# EAGLE design Talko_1_2 (EAGLE 7.5.0)
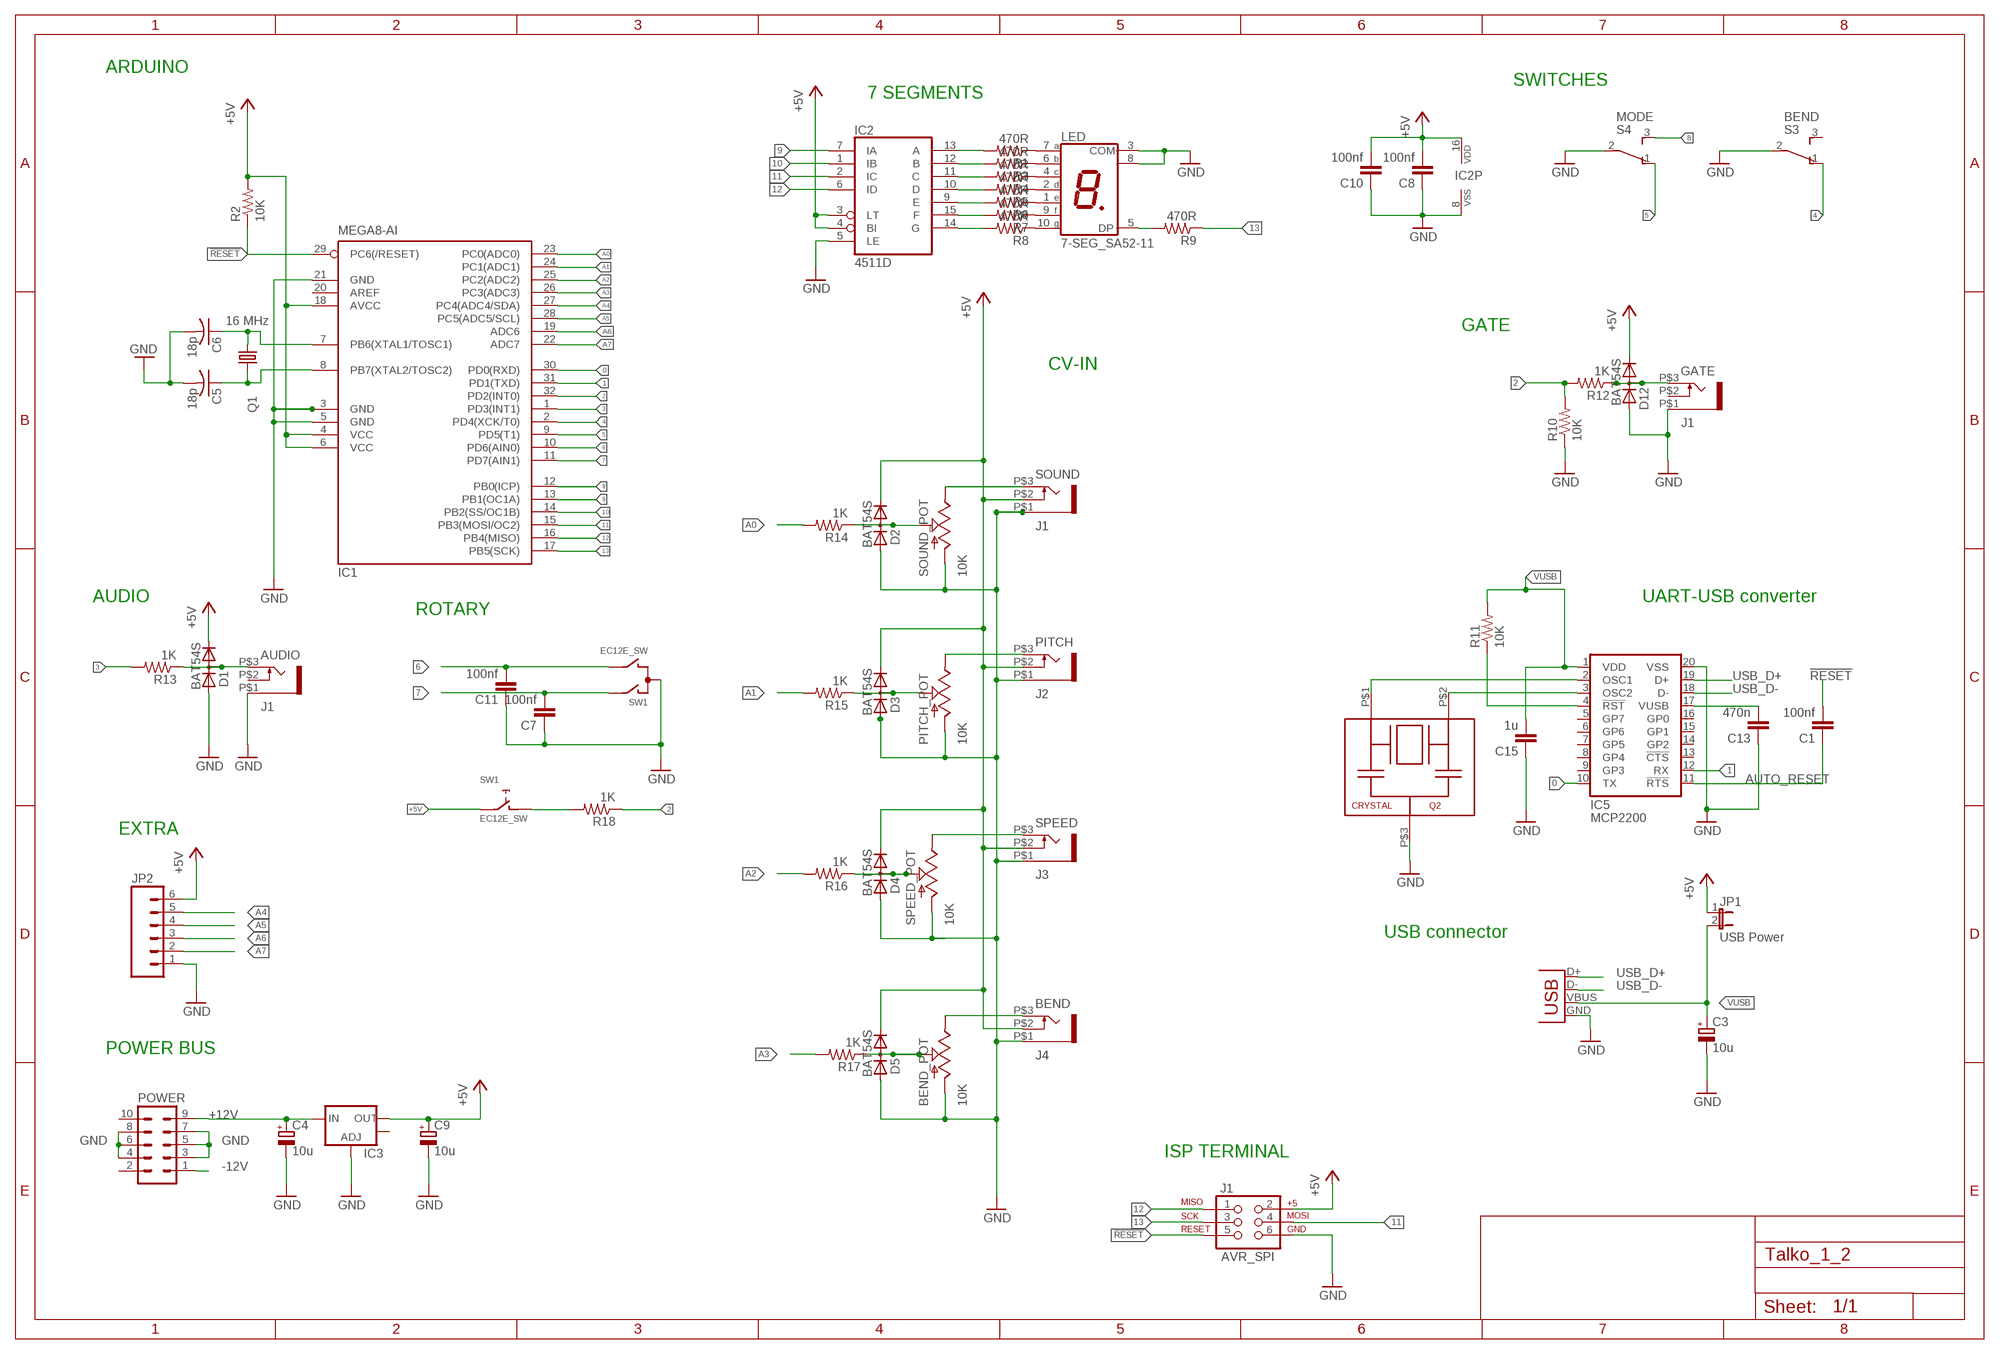
[diagram p0: schematic, sheet 1]

## Parts
AUDIO  J1  THONKICONN  [THONKICONN]
BEND  J4  THONKICONN  [THONKICONN]
BEND_POT  10K  POT  [ALPS_POT]
C1  100nf  C-EUC0805  [C0805]
C3  10u  CPOL-EUR/2012-12R  [R/2012-12R]
C4  10u  CPOL-EUR/2012-12R  [R/2012-12R]
C5  18p  C-USC0805K  [C0805K]
C6  18p  C-USC0805K  [C0805K]
C7  100nf  C-EUC0805  [C0805]
C8  100nf  C-EUC0805  [C0805]
C9  10u  CPOL-EUR/2012-12R  [R/2012-12R]
C10  100nf  C-EUC0805  [C0805]
C11  100nf  C-EUC0805  [C0805]
C13  470n  CAP0805  [0805]
C15  1u  CAP0805  [0805]
D1  BAT54S  DIODE_2CACA-SOT23  [SOT23]
D2  BAT54S  DIODE_2CACA-SOT23  [SOT23]
D3  BAT54S  DIODE_2CACA-SOT23  [SOT23]
D4  BAT54S  DIODE_2CACA-SOT23  [SOT23]
D5  BAT54S  DIODE_2CACA-SOT23  [SOT23]
D12  BAT54S  DIODE_2CACA-SOT23  [SOT23]
GATE  J1  THONKICONN  [THONKICONN]
IC1  MEGA8-AI  [TQFP32-08]
IC2  4511D  [SO16]
IC3  V_REG_LM1117SOT223  [SOT223]
IC5  MCP2200  [SO20]
J1  AVR_SPI  AVR_SPI_PRG_62X3_LOCK  [2X3_LOCK]
JP1  USB Power  JP1E  [JP1]
JP2  M06SIP  [1X06]
LED  7-SEG_SA52-11  [SA52-11]
PITCH  J2  THONKICONN  [THONKICONN]
PITCH_POT  10K  POT  [ALPS_POT]
POWER  10_PIN_HEADER  [MA05-2]
Q1  16 MHz  CRYSTALCTS406  [CTS406]
Q2  CRYSTAL  [CRYSTAL]
R1  470R  R-US_M0805  [M0805]
R2  10K  R-US_M0805  [M0805]
R3  470R  R-US_M0805  [M0805]
R4  470R  R-US_M0805  [M0805]
R5  470R  R-US_M0805  [M0805]
R6  470R  R-US_M0805  [M0805]
R7  470R  R-US_M0805  [M0805]
R8  470R  R-US_M0805  [M0805]
R9  470R  R-US_M0805  [M0805]
R10  10K  R-US_M0805  [M0805]
R11  10K  R-US_M0805  [M0805]
R12  1K  R-US_M0805  [M0805]
R13  1K  R-US_M0805  [M0805]
R14  1K  R-US_M0805  [M0805]
R15  1K  R-US_M0805  [M0805]
R16  1K  R-US_M0805  [M0805]
R17  1K  R-US_M0805  [M0805]
R18  1K  R-US_M0805  [M0805]
S3  BEND  TL36PO  [TL3XPO]
S4  MODE  TL36PO  [TL3XPO]
SOUND  J1  THONKICONN  [THONKICONN]
SOUND_POT  10K  POT  [ALPS_POT]
SPEED  J3  THONKICONN  [THONKICONN]
SPEED_POT  10K  POT  [ALPS_POT]
SW1  EC12E_SW  [ALPS_EC12E_SW]
X3  USB  USBPTH-VERTICAL  [USB-B-PTH-VERTICAL]

## Nets
0: IC1.30(PD0(RXD)) IC5.10(TX)
1: IC1.31(PD1(TXD)) IC5.12(RX)
2: IC1.32(PD2(INT0)) R10.2 R12.2 R18.1
3: IC1.1(PD3(INT1)) R13.2
4: IC1.2(PD4(XCK/T0)) S3.1(O)
5: IC1.9(PD5(T1)) S4.1(O)
6: C11.2 IC1.10(PD6(AIN0)) SW1.B
7: C7.2 IC1.11(PD7(AIN1)) SW1.A
8: IC1.12(PB0(ICP)) S4.3(S)
9: IC1.13(PB1(OC1A)) IC2.7(IA)
10: IC1.14(PB2(SS/OC1B)) IC2.1(IB)
11: IC1.15(PB3(MOSI/OC2)) IC2.2(IC) J1.4
12: IC1.16(PB4(MISO)) IC2.6(ID) J1.1
13: IC1.17(PB5(SCK)) J1.3 R9.1
!RESET: C1.2 IC1.29(PC6(/RESET)) J1.5 R2.1
+5V: BEND.P$2 C8.2 C9.+ C10.2 D1.2(C) D2.2(C) D3.2(C) D4.2(C) D5.2(C) D12.2(C) IC1.4(VCC) IC1.6(VCC) IC1.18(AVCC) IC2.3(LT) IC2.4(BI) IC2.16(VDD) IC3.2(OUT) J1.2 JP1.1 JP2.6 PITCH.P$2 R2.2 SOUND.P$2 SPEED.P$2 SW1.E
+12V: C4.+ IC3.3(IN) POWER.9
-12V [power]: POWER.1
A0: IC1.23(PC0(ADC0)) R14.2
A1: IC1.24(PC1(ADC1)) R15.2
A2: IC1.25(PC2(ADC2)) R16.2
A3: IC1.26(PC3(ADC3)) R17.2
A4: IC1.27(PC4(ADC4/SDA)) JP2.5
A5: IC1.28(PC5(ADC5/SCL)) JP2.4
A6: IC1.19(ADC6) JP2.3
A7: IC1.22(ADC7) JP2.2
AUTO_RESET: C1.1 IC5.11(!RTS)
GND: AUDIO.P$1 BEND.P$1 BEND_POT.P$3(A) C3.- C4.- C5.2 C6.2 C7.1 C8.1 C9.- C10.1 C11.1 C13.1 C15.1 D1.1(A) D2.1(A) D3.1(A) D4.1(A) D5.1(A) D12.1(A) GATE.P$1 IC1.3(GND) IC1.5(GND) IC1.21(GND) IC2.5(LE) IC2.8(VSS) IC3.1(ADJ) IC5.20(VSS) J1.6 JP2.1 LED.3(COM) LED.8(COM) PITCH.P$1 PITCH_POT.P$3(A) POWER.3 POWER.4 POWER.5 POWER.6 POWER.7 POWER.8 Q2.P$3 R10.1 S3.2(P) S4.2(P) SOUND.P$1 SOUND_POT.P$3(A) SPEED.P$1 SPEED_POT.P$3(A) SW1.C X3.GND
N$1: D12.3(AC) GATE.P$3 R12.1
N$2: SOUND.P$3 SOUND_POT.P$1(E)
N$3: C5.1 IC1.8(PB7(XTAL2/TOSC2)) Q1.1
N$4: LED.5(DP) R9.2
N$5: PITCH.P$3 PITCH_POT.P$1(E)
N$6: AUDIO.P$3 D1.3(AC) R13.1
N$7: SPEED.P$3 SPEED_POT.P$1(E)
N$8: IC2.13(A) R1.2
N$9: D2.3(AC) R14.1 SOUND_POT.P$2(S)
N$10: LED.7(A) R1.1
N$11: IC5.3(OSC2) Q2.P$2
N$12: C6.1 IC1.7(PB6(XTAL1/TOSC1)) Q1.3
N$13: R18.2 SW1.D
N$15: IC2.12(B) R3.2
N$16: LED.6(B) R3.1
N$17: IC2.11(C) R4.2
N$18: LED.4(C) R4.1
N$19: IC2.10(D) R5.2
N$20: LED.2(D) R5.1
N$21: IC2.9(E) R6.2
N$22: LED.1(E) R6.1
N$23: IC2.15(F) R7.2
N$24: LED.9(F) R7.1
N$25: IC2.14(G) R8.2
N$26: LED.10(G) R8.1
N$27: IC5.2(OSC1) Q2.P$1
N$28: IC5.4(!RST) R11.1
N$29: C13.2 IC5.17(VUSB)
N$30: D4.3(AC) R16.1 SPEED_POT.P$2(S)
N$31: D3.3(AC) PITCH_POT.P$2(S) R15.1
N$33: BEND_POT.P$2(S) D5.3(AC) R17.1
N$36: BEND.P$3 BEND_POT.P$1(E)
USB_D+: IC5.19(D+) X3.D+
USB_D-: IC5.18(D-) X3.D-
VUSB: C3.+ C15.2 IC5.1(VDD) JP1.2 R11.2 X3.VBUS
Unconnected: AUDIO.P$2 GATE.P$2 IC1.20(AREF) IC3.4(OUT) IC5.5(GP7) IC5.6(GP6) IC5.7(GP5) IC5.8(GP4) IC5.9(GP3) IC5.13(!CTS) IC5.14(GP2) IC5.15(GP1) IC5.16(GP0) POWER.2 POWER.10 S3.3(S) SW1.GND1(G) SW1.GND2(G)

## Notes on the sheet
- ARDUINO
- SWITCHES
- 7 SEGMENTS
- GATE
- CV-IN
- AUDIO | UART-USB converter
- ROTARY
- EXTRA
- USB connector
- POWER BUS
- ISP TERMINAL

## Library data of the parts
AUDIO BEND GATE PITCH SOUND SPEED = thonkiconn:THONKICONN
BEND_POT PITCH_POT SOUND_POT SPEED_POT = SparkFun-Electromechanical:POT; OC_FARNELL: 1769829; OC_MOUSER: 688-RK09L1140A2U
C1 C7 C8 C10 C11 = resistor:C-EU: CAPACITOR, European symbol; OC_MOUSER: 77-VJ0805V104MXBPBC
C3 C4 C9 = rcl:CPOL-EU: POLARIZED CAPACITOR, European symbol; OC_FARNELL: 1236657; OC_MOUSER: 581-F981C106MSAAS1
C5 C6 = rcl:C-US: CAPACITOR, American symbol; OC_MOUSER: 77-VJ0805A180GXQCBC
C13 = SparkFun:CAP: Capacitor Standard 0603 ceramic capacitor, and 0.1" leaded capacitor.; OC_FARNELL: 1457660; OC_MOUSER: 77-VJ0805Y474KXQTBC
C15 = SparkFun:CAP: Capacitor Standard 0603 ceramic capacitor, and 0.1" leaded capacitor.; OC_FARNELL: 2112910; OC_MOUSER: 77-VJ0805Y105KXQTBC
D1-D5 D12 = diode:DIODE_2CACA-: 2 Diodes - Cathode-Anode|Cathode-Anode; OC_MOUSER: 78-BAT54S-E3-08
IC1 = atmel:MEGA8: MICROCONTROLLER 8 Kbytes FLASH, 1 kbytes SRAM, 512 bytes EEPROM, USART, 6-channel 10 bit ADC, 2-channel 8 bit ADC Pin compatible with Atmega48, ATMega88, ATMega168 Source: avr.lbr; MPN: ATMEGA8-16AU; OC_FARNELL: 9171371; OC_MOUSER: 556-ATMEGA328P-AU; OC_NEWARK: 73M8863
IC2 = 45xx:4511: BCD to 7-segment LATCH/DECODER/DRIVER; OC_MOUSER: 863-MC14511BDG
IC3 = SparkFun-PowerIC:V_REG_LM1117: Voltage Regulator LM1117 Standard adjustable voltage regulator but in SMD form. Spark Fun Electronics SKU : COM-00595; OC_MOUSER: 621-AZ1117H-5.0TRE
IC5 = SteveMarple:MCP2200: MCP2200 Microchip USB-UART interface.; OC_FARNELL: 1781148; OC_MOUSER: 579-MCP2200-I/SO
J1 = SparkFun-Connectors:AVR_SPI_PRG_6: AVR ISP 6 Pin This is the reduced ISP connector for AVR programming. Common on Arduino. This footprint will take up less PCB space and can be used with a 10-pin to 6-pin adapter such as SKU: BOB-08508; OC_MOUSER: 571-826925-3
JP1 = jumper:JP1E: JUMPER; OC_MOUSER: 571-826646-2
JP2 = DECADE-libraries:M06: Header 6 Standard 6-pin 0.1" header. Use with straight break away headers (SKU : PRT-00116), right angle break away headers (PRT-00553), swiss pins (PRT-00743), machine pins (PRT-00117), and female headers (PRT-00115). Molex polarized connector foot print use with SKU : PRT-08094 with associated crimp pins and housings. NOTES ON THE VARIANTS LOCK and LOCK_LONGPADS... This footprint was designed to help hold the alignment of a through-hole component (i.e. 6-pin header) while soldering it into place. You may notice that each hole has been shifted either up or down by 0.005 of an inch from it's more standard position (which is a perfectly straight line). This slight alteration caused the pins (the squares in the middle) to touch the edges of the holes. Because they are alternating, it causes a "brace" to hold the component in place. 0.005 has proven to be the perfect amount of "off-center" position when using our standard breakaway headers. Although looks a little odd when you look at the bare footprint, once you have a header in there, the alteration is very hard to notice. Also, if you push a header all the way into place, it is covered up entirely on the bottom side. This idea of altering the position of holes to aid alignment will be further integrated into the Sparkfun Library for other footprints. It can help hold any component with 3 or more connection pins.
LED = display-kingbright:7-SEG_: Kingbright 14.2mm (0.56 INCH) SINGLE DIGIT NUMERIC DUISPLAY Source: SA56-11EWA(Ver1189471036.pdf; OC_FARNELL: 1168602; OC_MOUSER: 604-SC52-11SRWA; OC_NEWARK: unknown
POWER = TomW:10_PIN_HEADER: PIN HEADER; OC_FARNELL: unknown; OC_MOUSER: 571-5-146258-5; OC_NEWARK: unknown
Q1 = crystal:CRYSTAL: CRYSTAL; OC_FARNELL: unknown; OC_MOUSER: 774-406C35S16M00000; OC_NEWARK: unknown
Q2 = 57466:CRYSTAL; OC_FARNELL: 1218535; OC_MOUSER: 581-PBRC12.00HR50X
R1 R3-R9 = resistor:R-US_: RESISTOR, American symbol; OC_MOUSER: 754-RR1220P-471D
R2 R10 R11 = resistor:R-US_: RESISTOR, American symbol; OC_MOUSER: 754-RR1220P-103D
R12-R18 = resistor:R-US_: RESISTOR, American symbol; OC_MOUSER: 71-TNPW08051K00BEEA
S3 S4 = switch:TL36PO: TINY SWITCH ON - ON Source: http://www2.produktinfo.conrad.com/datenblaetter/700000-724999/705152-da-01-de-Subminiaturschalter_TL_36YO.pdf; OC_FARNELL: 9472967; OC_MOUSER: 612-200ASP1T1A1M2R
SW1 = switch-alps:EC12E_SW: ALPS rotary Encoder EC12E series with switch; MPN: EC12E2424407; OC_FARNELL: 1520813; OC_MOUSER: PEC11R-4215K-S0024; OC_NEWARK: 74M1068
X3 = SteveMarple:USB: USB Connectors USB-B-PTH is fully proven SKU : PRT-00139 USB-miniB is fully proven SKU : PRT-00587 USB-A-PCB is untested. USB-A-H is throughly reviewed, but untested. Spark Fun Electronics SKU : PRT-00437 USB-B-SMT is throughly reviewed, but untested. Needs silkscreen touching up. USB-A-S has not been used/tested USB-MB-H has not been used/tested; OC_MOUSER: 855-M701-330442

## Net classes
1 power: width 0.61 mm
2 ground: width 0.61 mm

## Board
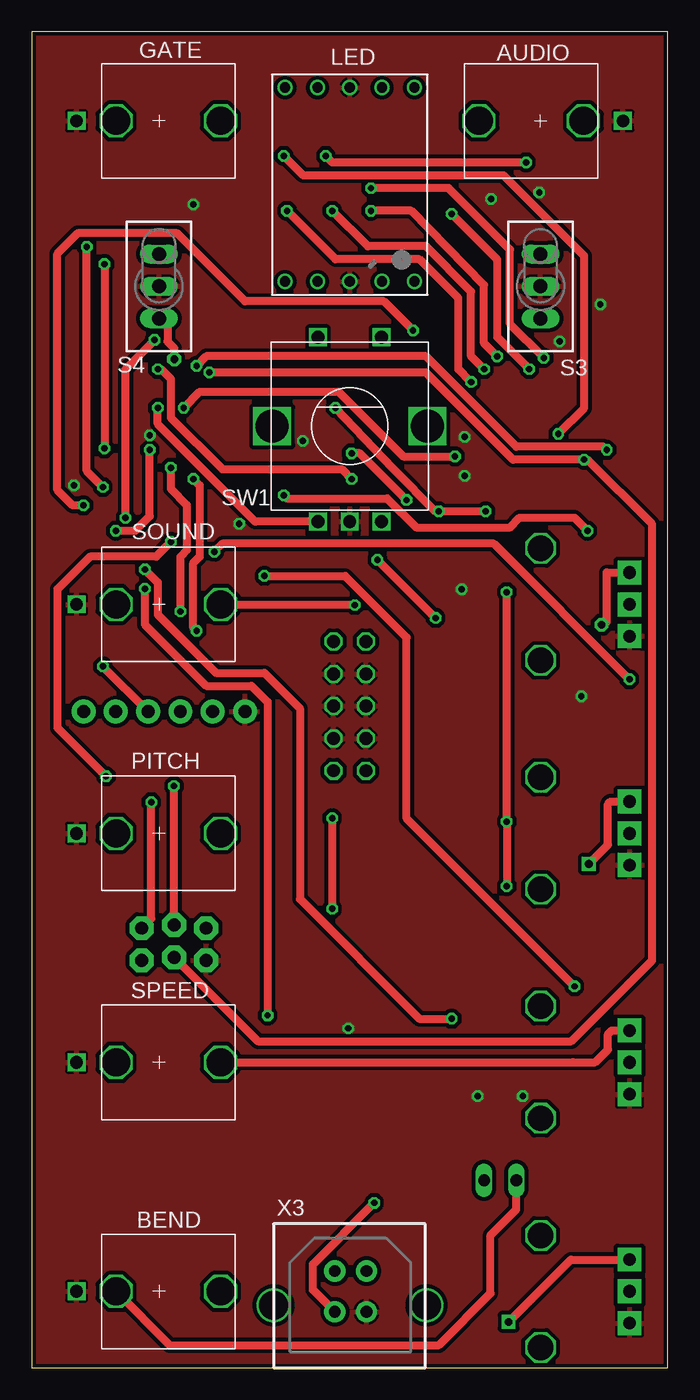
[diagram p1: board, top side]
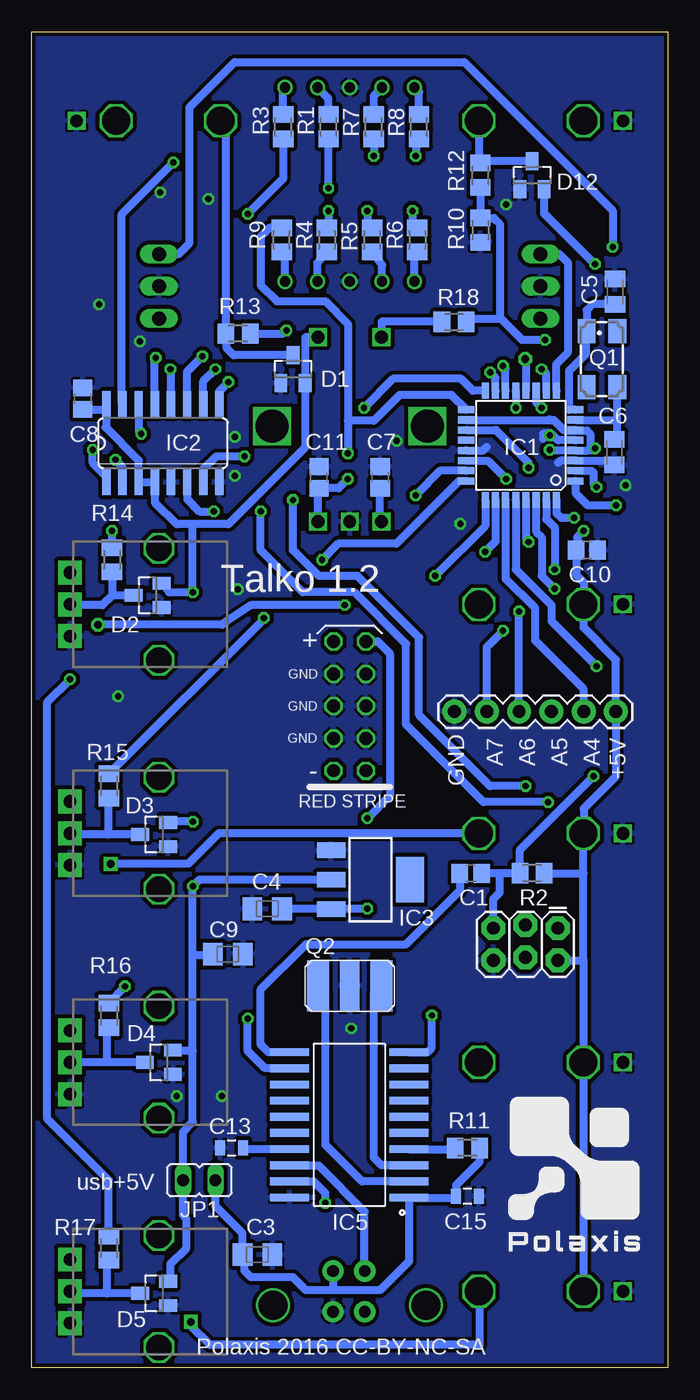
[diagram p2: board, bottom side, seen from below]

Size 50 x 105 mm. Coordinates in mm from the lower left corner, seen from the top.
Outline: 0,0 50,0 50,105 0,105 0,0
Copper layers (1*16): Top 0.035mm / dielectric 1.5mm / Bottom 0.035mm
Design rules "PCB-POOL Standard": minimum track width 0.15mm, minimum drill 0.3mm, track to track 0.15mm, track to pad 0.15mm, pad to pad 0.15mm, via to via 0.15mm, smd to smd 0.15mm, copper to edge 0.3mm, drill to drill 0.2mm, minimum pad ring 0.2mm, minimum via ring 0.15mm, stop-mask expansion 0.075mm, vias tented up to drill 0mil, thermal gap 0.2mm

### Footprints (pad centres in the part's own frame; a part is rotated, then mirrored left to right if it is on the bottom)
THONKICONN = drill 1 square: P$1 0,-6.48 | drill 2.2 octagon: P$2 0,-3.38; P$3 0,4.84
ALPS_POT = drill 1 pad 1.88 square: P$1 7,-2.5; P$2 7,0; P$3 7,2.5 | drill 2 octagon: P$4 0,-4.4; P$5 0,4.4
C0805 = smd 1.3 x 1.5: 1 -0.85,0; 2 0.85,0
R/2012-12R = smd 1.55 x 1.8: + 1.175,0; - -1.175,0
C0805K = smd 1.3 x 1.6: 1 -1,0; 2 1,0
0805 = smd 0.8 x 1.2: 1 -0.9,0; 2 0.9,0
SOT23 = smd 1 x 1.4: 1 -0.95,-1.1; 2 0.95,-1.1; 3 0,1.1
TQFP32-08 = smd 1.27 x 0.559: 1 -4.293,2.8; 2 -4.293,2; 3 -4.293,1.2; 4 -4.293,0.4; 5 -4.293,-0.4; 6 -4.293,-1.2; 7 -4.293,-2; 8 -4.293,-2.8; 17 4.293,-2.8; 18 4.293,-2; 19 4.293,-1.2; 20 4.293,-0.4; 21 4.293,0.4; 22 4.293,1.2; 23 4.293,2; 24 4.293,2.8 | smd 0.559 x 1.27: 9 -2.8,-4.293; 10 -2,-4.293; 11 -1.2,-4.293; 12 -0.4,-4.293; 13 0.4,-4.293; 14 1.2,-4.293; 15 2,-4.293; 16 2.8,-4.293; 25 2.8,4.293; 26 2,4.293; 27 1.2,4.293; 28 0.4,4.293; 29 -0.4,4.293; 30 -1.2,4.293; 31 -2,4.293; 32 -2.8,4.293
SO16 = smd 0.66 x 2.032: 1 -4.445,-3.073; 2 -3.175,-3.073; 3 -1.905,-3.073; 4 -0.635,-3.073; 5 0.635,-3.073; 6 1.905,-3.073; 7 3.175,-3.073; 8 4.445,-3.073; 9 4.445,3.073; 10 3.175,3.073; 11 1.905,3.073; 12 0.635,3.073; 13 -0.635,3.073; 14 -1.905,3.073; 15 -3.175,3.073; 16 -4.445,3.073
SOT223 = smd 1.219 x 2.235: 1 -2.311,-3.099; 2 0,-3.099; 3 2.311,-3.099 | smd 3.6 x 2.2: 4 0,3.099
SO20 = smd 0.61 x 3.048: 1 -5.715,-4.699; 2 -4.445,-4.699; 3 -3.175,-4.699; 4 -1.905,-4.699; 5 -0.635,-4.699; 6 0.635,-4.699; 7 1.905,-4.699; 8 3.175,-4.699; 9 4.445,-4.699; 10 5.715,-4.699; 11 5.715,4.699; 12 4.445,4.699; 13 3.175,4.699; 14 1.905,4.699; 15 0.635,4.699; 16 -0.635,4.699; 17 -1.905,4.699; 18 -3.175,4.699; 19 -4.445,4.699; 20 -5.715,4.699
2X3_LOCK = drill 1.016 pad 1.88 octagon: 1 0,0; 2 0,2.54; 3 2.54,-0.254; 4 2.54,2.286; 5 5.08,0; 6 5.08,2.54
JP1 = drill 0.914 long: 1 0,-1.27; 2 0,1.27
1X06 = drill 1.016 pad 1.88: 1 0,0; 2 2.54,0; 3 5.08,0; 4 7.62,0; 5 10.16,0; 6 12.7,0
SA52-11 = drill 0.8: 1 -5.08,-7.62; 2 -2.54,-7.62; 3 0,-7.62; 4 2.54,-7.62; 5 5.08,-7.62; 6 5.08,7.62; 7 2.54,7.62; 8 0,7.62; 9 -2.54,7.62; 10 -5.08,7.62
MA05-2 = drill 1.016 octagon: 1 -5.08,-1.27; 2 -5.08,1.27; 3 -2.54,-1.27; 4 -2.54,1.27; 5 0,-1.27; 6 0,1.27; 7 2.54,-1.27; 8 2.54,1.27; 9 5.08,-1.27; 10 5.08,1.27
CTS406 = smd 1.9 x 1.4: 1 -2.2,-1.2; 2 2.2,-1.2; 3 2.2,1.2; 4 -2.2,1.2
CRYSTAL = smd 1.7 x 4: P$1 -2.5,0; P$2 2.5,0 | smd 1.5 x 4: P$3 0,0
M0805 = smd 1.3 x 1.6: 1 -0.95,0; 2 0.95,0
TL3XPO = drill 1.1 pad 1.422 long: 1 -2.54,0; 2 0,0; 3 2.54,0
ALPS_EC12E_SW = drill 1 square: A -2.5,-7.5; B 2.5,-7.5; C 0,-7.5; D -2.5,7; E 2.5,7 | drill 2.6 square: GND1 -6.1,0; GND2 6.1,0
USB-B-PTH-VERTICAL = drill 0.914 pad 1.676: D+ 4.826,4.394; D- 4.826,7.595; GND 7.315,4.394; VBUS 7.315,7.595 | drill 2.286: P$1 0,4.902; P$2 12.04,4.902

### Placement (x,y rotation side)
AUDIO  40,98 90 top
BEND  10,6 270 top
BEND_POT  40,6 180 bottom
C1  15.49,38.86 0 bottom
C3  32.26,8.89 180 bottom
C4  31.5,36.07 0 bottom
C5  4.14,84.58 90 bottom
C6  4.19,71.95 270 bottom
C7  22.61,69.98 270 bottom
C8  45.98,76.17 270 bottom
C9  34.58,32.5 180 bottom
C10  6.35,64.26 180 bottom
C11  27.43,69.98 270 bottom
C13  34.29,17.27 0 bottom
C15  15.75,13.46 180 bottom
D1  29.46,78.49 0 bottom
D2  40.89,60.71 90 bottom
D3  40.39,41.91 90 bottom
D4  40.01,24 90 bottom
D5  40.39,5.84 90 bottom
D12  10.67,93.73 0 bottom
GATE  10,98 270 top
IC1  11.55,72.5 180 bottom
IC2  39.69,72.67 0 bottom
IC3  23.37,38.35 270 bottom
IC5  25.04,19.08 90 bottom
J1  8.64,34.54 180 bottom
JP1  36.83,14.73 270 bottom
JP2  16.76,51.56 0 bottom
LED  25,93 0 top
PITCH  10,42 270 top
PITCH_POT  40,42 180 bottom
POWER  25,52 90 bottom
Q1  5.17,79.28 270 bottom
Q2  25,30 0 bottom
R1  26.67,97.54 270 bottom
R2  10.67,38.86 0 bottom
R3  30.23,97.54 270 bottom
R4  26.8,88.65 90 bottom
R5  23.24,88.65 90 bottom
R6  19.68,88.65 90 bottom
R7  23.11,97.54 270 bottom
R8  19.56,97.54 270 bottom
R9  30.35,88.65 270 bottom
R10  14.73,89.41 90 bottom
R11  15.75,17.27 0 bottom
R12  14.73,93.73 270 bottom
R13  33.78,81.28 0 bottom
R14  43.69,63.5 90 bottom
R15  43.94,45.72 90 bottom
R16  43.94,27.69 90 bottom
R17  43.94,9.4 90 bottom
R18  16.8,82.2 180 bottom
S3  40,85 270 top
S4  10,85 270 top
SOUND  10,60 270 top
SOUND_POT  40,60 180 bottom
SPEED  10,24 270 top
SPEED_POT  40,24 180 bottom
SW1  25,74 0 top
X3  19,0 0 top

### Tracks (layer width: path | path; a pad name or v marks a point on that pad's centre or on a via)
0  (via drill 0.5)
  Top 0.61: v8.89,61.21 8.89,58.42 13.72,53.59 17.27,53.59 18.54,52.32 v18.54,27.69
  Bottom 0.61: IC5.10 18.89,24.8 18.54,25.15 v18.54,27.69 | IC1.30 10.35,65.72 9.91,65.28 9.91,62.23 v8.89,61.21
1  (via drill 0.5)
  Top 0.61: v8.89,62.74 9.91,61.72 9.91,59.18 14.48,54.61 18.29,54.61 21.08,51.82 21.08,36.83 30.48,27.43 v33.02,27.43
  Bottom 0.61: IC5.12 31.66,23.53 33.02,24.89 v33.02,27.43 | IC1.31 9.55,66.7 8.89,66.04 v8.89,62.74
2  (via drill 0.5)
  Top 0.61: v7.37,66.8 7.37,78.49 v9.65,80.77
  Bottom 0.61: R12.2 R10.2 13.65,90.36 13.21,89.92 13.21,82.55 13.08,82.42 | IC1.32 8.75,67.17 8.38,66.8 v7.37,66.8 | v9.65,80.77 11.43,80.77 13.08,82.42 | 13.08,82.42 15.85,82.42 R18.1
3  (via drill 0.5)
  Top 0.61: v29.97,81.53 27.69,83.82 16.76,83.82 11.43,89.15 3.6,89.15 2,87.55 2,69 3.22,67.78 v4.06,67.78
  Bottom 0.61: R13.2 30.23,81.28 v29.97,81.53 | IC1.1 7.25,68.75 6.28,67.78 v4.06,67.78
4  (via drill 0.5)
  Top 0.61: v5.59,69.22 4.32,70.48 v4.32,88.09
  Bottom 0.61: v4.32,88.09 4.32,90.93 16,102.62 34.04,102.62 37.59,99.06 37.59,88.39 38.44,87.54 S3.1 | IC1.2 5.98,70.5 5.84,70.36 5.84,69.47 v5.59,69.22
5
  Bottom 0.61: IC1.9 8.75,78.88 7.86,79.77 7.86,86.86 8.54,87.54 S4.1
6  (via drill 0.5)
  Top 0.61: v9.91,78.49 10.16,78.49 10.92,77.72 10.92,74.68 14.99,70.61 24.38,70.61 v25.15,69.85
  Bottom 0.61: SW1.B 27.5,69.06 C11.2 25.87,69.13 v25.15,69.85 | IC1.10 9.55,78.13 v9.91,78.49
7  (via drill 0.5)
  Top 0.61: SW1.A 17.57,66.5 9.91,74.17 v9.91,75.44
  Bottom 0.61: 22.5,69.02 C7.2 22.61,66.61 SW1.A | IC1.11 10.35,75.88 v9.91,75.44
8  (via drill 0.6)
  Top 0.61: S4.3 10.68,81.78 10.68,80.65 11.2,80.12 v11.2,79.28
  Bottom 0.61: v11.2,79.28 11.15,79.22 IC1.12
9  (via drill 0.5)
  Top 0.61: v11.94,75.44 13.21,76.71 24.13,76.71 29.21,71.63 v33.27,71.63
  Bottom 0.61: IC2.7 36.52,70.61 | 36.52,70.61 36.52,70.67 | IC1.13 11.94,76.78 v11.94,75.44 | v33.27,71.63 35.5,71.63 36.52,70.61
10  (via drill 0.5)
  Top 0.61: v45.21,72.14 44.96,72.39 38.1,72.39 30.99,79.5 13.72,79.5 v12.95,78.74
  Bottom 0.61: IC2.1 44.13,70.04 45.21,71.12 v45.21,72.14 | IC1.14 12.75,78.53 v12.95,78.74
11  (via drill 0.5)
  Top 0.61: v13.97,78.23 30.99,78.23 37.85,71.37 v43.43,71.37 43.69,71.37 48.77,66.29 48.77,32 42.42,25.65 17.78,25.65 J1.4
  Bottom 0.61: IC2.2 42.87,70.81 v43.43,71.37 | IC1.15 13.55,77.81 v13.97,78.23
12  (via drill 0.5)
  Top 0.61: J1.1 9.4,35.31 v9.4,44.45 | v23.88,75.44 28.45,70.61 31.75,67.31 v32,67.31 v35.69,67.31
  Bottom 0.61: IC2.6 37.78,68.27 36.83,67.31 v35.69,67.31 | IC1.16 15.32,76.79 16.26,77.72 21.59,77.72 v23.88,75.44 | v9.4,44.45 14.48,44.45 20.57,50.55 20.57,56.9 24.64,60.96 28.7,60.96 32,64.26 v32,67.31
13  (via drill 0.5)
  Top 0.61: J1.3 v11.18,45.72 | v29.46,68.2 25.78,71.88 v25.15,71.88
  Bottom 0.61: R9.1 31.31,89.6 32,88.9 32,85.09 30.73,83.82 26.92,83.82 25.15,82.04 25.15,74.42 | v11.18,45.72 13.97,45.72 19.56,51.31 19.56,57.4 24.38,62.23 27.43,62.23 29.46,64.26 v29.46,68.2 | 25.15,74.42 v25.15,71.88 | IC1.17 17,76.45 21.08,76.45 23.11,74.42 25.15,74.42
!RESET  (via drill 0.5)
  Top 0.61: v5.84,46.48 2.03,50.29 2.03,61.21 4.57,63.75 9.78,63.75 v10.92,64.9
  Bottom 0.61: 13.21,38.86 R2.1 11.62,40.71 v5.84,46.48 | 13.21,38.86 C1.2 | J1.5 13.72,36.83 13.21,37.34 13.21,38.86 | IC1.29 11.15,65.12 v10.92,64.9
+5V  (via drill 0.5)
  Top 0.61: v6.6,65.79 8.13,65.79 9.27,66.93 v9.27,72.14 | BEND.P$2 10.84,1.78 32,1.78 36.07,5.84 36.07,10.41 38.1,12.45 JP1.1 | v37.34,60.96 v37.34,42.93 v37.34,37.85 | v5.71,86.74 v5.71,72.25
  Bottom 0.61: D5.2 39.12,6.96 39.12,8.13 37.85,9.4 37.85,11.68 38.1,11.94 JP1.1 38.1,18.54 37.34,19.3 37.34,24.89 | IC2.16 44.13,75.25 | 44.13,75.25 44.13,73.85 44.2,73.91 41.59,71.31 IC2.3 IC2.4 40.33,68.01 38.61,66.29 37.34,66.29 | PITCH.P$2 6.62,41.96 | PITCH.P$2 6.6,42.02 6.6,43.94 4.06,46.48 JP2.6 4.06,55.63 6.6,58.17 6.6,59.98 SOUND.P$2 6.6,60.02 6.6,61.72 7.2,62.32 C10.2 7.11,64.48 7.11,65.28 v6.6,65.79 | IC1.6 8.17,73.7 | 8.17,73.7 8.97,74.5 | IC1.18 8.97,74.5 | 8.17,73.7 8.13,73.66 6.35,73.66 6.1,73.41 6.1,72.26 6.26,72.1 | v9.27,72.14 9.23,72.1 IC1.4 6.26,72.1 | IC3.2 36.83,38.35 v37.34,37.85 37.34,32.4 | v37.34,42.93 39.22,42.93 D3.2 | 37.34,24.89 37.34,32.4 | D4.2 37.4,24.95 37.34,24.89 | 6.62,32 6.62,38.86 | 6.62,38.86 PITCH.P$2 | R2.2 6.62,38.86 | J1.2 6.62,32 | D12.2 9.72,90.74 v5.71,86.74 | 37.34,66.29 34.54,66.29 28.51,72.32 D1.2 28.51,81 SW1.E | 9.27,74.55 9.14,74.45 8.97,74.5 | BEND.P$2 SPEED.P$2 6.62,32 | D2.2 39.22,60.96 v37.34,60.96 37.34,66.29 | v5.71,72.25 6.06,72.1 6.26,72.1 | C8.2 44.21,75.32 44.13,75.25 | C9.+ 35.86,32.4 37.34,32.4
+12V  (via drill 0.5)
  Top 0.61: v23.62,43.18 v23.62,36.07
  Bottom 0.61: C4.+ 30.3,36.04 IC3.3 26.44,36.07 v23.62,36.07 | POWER.9 22.79,57.08 21.84,56.13 21.84,44.96 v23.62,43.18
A0  (via drill 0.5)
  Top 0.61: v19.81,68.58 20.07,68.33 27.94,68.33 30.23,66.04 37.59,66.04 38.35,66.8 42.67,66.8 v43.69,65.79
  Bottom 0.61: R14.2 v43.69,65.79 | IC1.23 17.89,70.5 v19.81,68.58
A1  (via drill 0.5)
  Top 0.61: 31.75,58.86 v31.75,58.93 v27.18,63.5
  Bottom 0.61: R15.2 31.75,58.86 v31.75,58.93 | IC1.24 16.41,69.7 21.34,64.77 25.91,64.77 v27.18,63.5
A2  (via drill 0.5)
  Top 0.61: v42.67,29.97 29.46,43.18 29.46,57.4 24.64,62.23 v18.29,62.23
  Bottom 0.61: R16.2 v42.67,29.97 | IC1.25 14.35,66.17 v18.29,62.23
A3  (via drill 0.5)
  Top 0.61: v14.35,64.14 14.99,64.77 36.32,64.77 v46.99,54.1
  Bottom 0.61: R17.2 43.94,14.73 48.77,19.56 48.77,52.32 v46.99,54.1 | IC1.26 13.55,64.94 v14.35,64.14
A4
  Bottom 0.61: IC1.27 12.75,62.02 10.41,59.69 10.41,57.15 6.6,53.34 JP2.5
A5  (via drill 0.5)
  Top 0.61: v5.59,55.12 JP2.4
  Bottom 0.61: IC1.28 11.95,62.75 9.14,59.94 9.14,58.67 v5.59,55.12
A6  (via drill 0.5)
  Top 0.61: v11.68,59.44 11.68,63.75 12.19,64.26 12.19,67.82 10.92,69.09 v10.92,70.74
  Bottom 0.61: JP2.3 v11.68,59.44 | IC1.19 13.5,73.7 10.92,71.12 v10.92,70.74
A7  (via drill 0.5)
  Top 0.61: v12.95,57.91 12.7,58.17 12.7,63.25 13.21,63.75 13.21,69.34 v12.7,69.85
  Bottom 0.61: JP2.2 14.22,56.64 v12.95,57.91 | IC1.22 14.15,71.3 v12.7,69.85
AUTO_RESET
  Bottom 0.61: IC5.11 31.4,24.8 32,25.4 32,29.72 28.45,33.27 20.57,33.27 16.34,37.5 C1.1
GND  (via drill 0.5)
  Bottom 0.61: 8.64,71.12 8.46,71.3 IC1.3 4.83,71.3 4.48,70.95 C6.2 | IC1.5 8.64,72.9 9.14,73.41 9.78,73.41 9.78,73.03 | IC1.21 14.52,72.1 14.22,72.39
  other vias: 35.05,21.34 38.61,21.34 24.89,26.67 12.7,91.44 44.7,83.57 3.3,69.34 9.27,73.28 34.04,70.1 34.04,73.15 33.81,61.18 21.3,72.84 16.3,66.34 43.21,52.78 41.5,80.67 39.9,92.37 36.1,91.87
  pour Top (isolate 0.305): 0,106.68 50.04,106.68 50.04,0 0,0
  pour Bottom (isolate 0.305): 0,105.66 49.78,105.66 50.04,0 0,0
N$1
  Bottom 0.61: D12.3 14.58,94.83 R12.1 14.84,94.78 GATE.P$3
N$2  (via drill 0.5, 0.6 pad 0.15)
  Top 0.61: SOUND.P$3 25.34,60 v25.4,59.94 | v44.8,58.4 45.2,58.6 45.2,62.5 SOUND_POT.P$1
  Bottom 0.61: v25.4,59.94 32.77,59.94 34.92,58.48 35.01,58.4 v44.8,58.4
N$3
  Bottom 0.61: IC1.8 7.75,75.3 7.75,78.38 6.4,79.72 6.4,81.45 Q1.1 6.38,83.12 5.92,83.58 C5.1
N$4
  Bottom 0.61: LED.5 30.08,87.59 R9.2
N$5  (via drill 0.6)
  Top 0.61: v43.8,39.6 45.3,41.1 45.3,44.3 45.5,44.5 PITCH_POT.P$1
  Bottom 0.61: PITCH.P$3 35.3,42 37.7,39.6 v43.8,39.6
N$6
  Bottom 0.61: D1.3 34.12,79.59 34.67,80.14 34.67,81.22 R13.1 34.73,97.57 AUDIO.P$3
N$7
  Top 0.61: SPEED.P$3 42.55,24 44.3,24 45.3,25 45.3,26.2 45.6,26.5 SPEED_POT.P$1
N$8  (via drill 0.5)
  Top 0.61: v40.26,79.38 37.59,82.04 37.59,87.88 32.77,92.71 v26.67,92.71
  Bottom 0.61: IC2.13 40.33,79.31 v40.26,79.38 | v26.67,92.71 R1.2
N$9
  Bottom 0.61: D2.3 43.69,60.71 | 43.69,60.71 44.45,59.94 47,59.94 SOUND_POT.P$2 | R14.1 43.69,60.71
N$10
  Bottom 0.61: R1.1 26.67,99.75 LED.7
N$11
  Bottom 0.61: IC5.3 22.51,15.91 23.11,16.51 23.11,29.39 Q2.P$2
N$12
  Bottom 0.61: C6.1 3.98,72.95 3.98,74.5 | Q1.3 3.98,74.5 | IC1.7 3.98,74.5
N$13
  Bottom 0.61: R18.2 22.5,82.2 SW1.D
N$15  (via drill 0.5)
  Top 0.61: v39.12,78.49 36.58,81.03 36.58,87.12 v33.02,90.68
  Bottom 0.61: IC2.12 39.05,78.04 v39.12,78.49 | R3.2 30.23,93.47 v33.02,90.68
N$16
  Bottom 0.61: R3.1 30.23,100.47 LED.6
N$17  (via drill 0.5)
  Top 0.61: v36.58,79.5 35.56,80.52 35.56,85.09 29.84,90.93 v26.67,90.93
  Bottom 0.61: IC2.11 37.78,78.29 v36.58,79.5 | v26.67,90.93 26.67,89.6 R4.2
N$18
  Bottom 0.61: LED.4 27.54,86.83 R4.1
N$19  (via drill 0.5)
  Top 0.61: v35.56,78.49 34.54,79.5 34.54,84.58 30.99,88.14 26.42,88.14 v23.62,90.93
  Bottom 0.61: IC2.10 36.52,77.53 v35.56,78.49 | v23.62,90.93 23.62,89.66 23.62,89.6 R5.2
N$20
  Bottom 0.61: LED.2 22.46,86.66 R5.1
N$21  (via drill 0.5)
  Top 0.61: v34.54,77.47 33.53,78.49 33.53,84.07 30.48,87.12 23.88,87.12 v20.07,90.93
  Bottom 0.61: IC2.9 35.24,76.77 v34.54,77.47 | v20.07,90.93 20.07,89.92 R6.2
N$22
  Bottom 0.61: LED.1 19.92,87.55 R6.1
N$23  (via drill 0.5)
  Top 0.61: v23.11,95.25 23.62,94.74 v38.86,94.74
  Bottom 0.61: IC2.15 42.93,75.8 42.93,90.68 v38.86,94.74 | R7.2 v23.11,95.25
N$24
  Bottom 0.61: R7.1 23.11,99.97 LED.9
N$25  (via drill 0.5)
  Top 0.61: v41.4,73.41 43.43,75.44 43.43,87.38 37.08,93.73 21.34,93.73 v19.81,95.25
  Bottom 0.61: R8.2 19.81,96.59 v19.81,95.25 | IC2.14 41.59,73.6 v41.4,73.41
N$26
  Bottom 0.61: R8.1 19.56,100.26 LED.10
N$27
  Bottom 0.61: IC5.2 24.04,14.64 26.92,17.53 26.92,29.42 Q2.P$1
N$28
  Bottom 0.61: IC5.4 16.7,17.18 R11.1
N$29
  Bottom 0.61: IC5.17 33.39,17.18 C13.2
N$30
  Bottom 0.61: D4.3 44.1,24 | 44.1,24 SPEED_POT.P$2 | R16.1 44.1,26.74 44.1,24
N$31
  Bottom 0.61: D3.3 44,41.91 | 44,41.91 47,41.91 PITCH_POT.P$2 | R15.1 44,44.77 44,41.91
N$33
  Bottom 0.61: D5.3 44.1,5.84 | 44.1,5.84 47,5.84 BEND_POT.P$2 | R17.1 44.1,8.45 44.1,5.84
N$36  (via drill 0.6)
  Top 0.61: v37.5,3.6 42.4,8.5 BEND_POT.P$1
  Bottom 0.61: BEND.P$3 14.8,5.96 14.8,1.8 36,1.8 37.5,3.3 v37.5,3.6
USB_D+  (via drill 0.5)
  Top 0.61: X3.D+ 22.1,6.12 22.1,8.13 v26.92,12.95
  Bottom 0.61: v26.92,12.95 26.92,13.72 27.85,14.64 IC5.19
USB_D-
  Bottom 0.61: X3.D- 23.83,12.27 27.43,15.88 29.7,15.88 IC5.18
VUSB
  Bottom 0.61: R11.2 14.8,16.19 16.64,14.35 16.64,13.47 C15.2 16.65,13.37 IC5.1 20.34,8.36 22.61,6.1 26.42,6.1 | JP1.2 35.56,12.7 33.43,10.57 C3.+ 33.27,8.73 33.27,7.62 32.77,7.11 29.46,7.11 28.45,6.1 26.42,6.1 | X3.VBUS 26.32,6.2 26.42,6.1

### Text on the board
bNames: Talko 1.2 | +5V | A4 | A5 | A6 | A7 | GND | usb+5V | Polaxis 2016 CC-BY-NC-SA
200bmp: C:/Users/Kovari Andrei/Desktop/Fiverr/deladriere/Project 4/logo.bmp